# Altium project AutonomousVehicle_MotherBoard.PrjPcb (part 1 of 2)
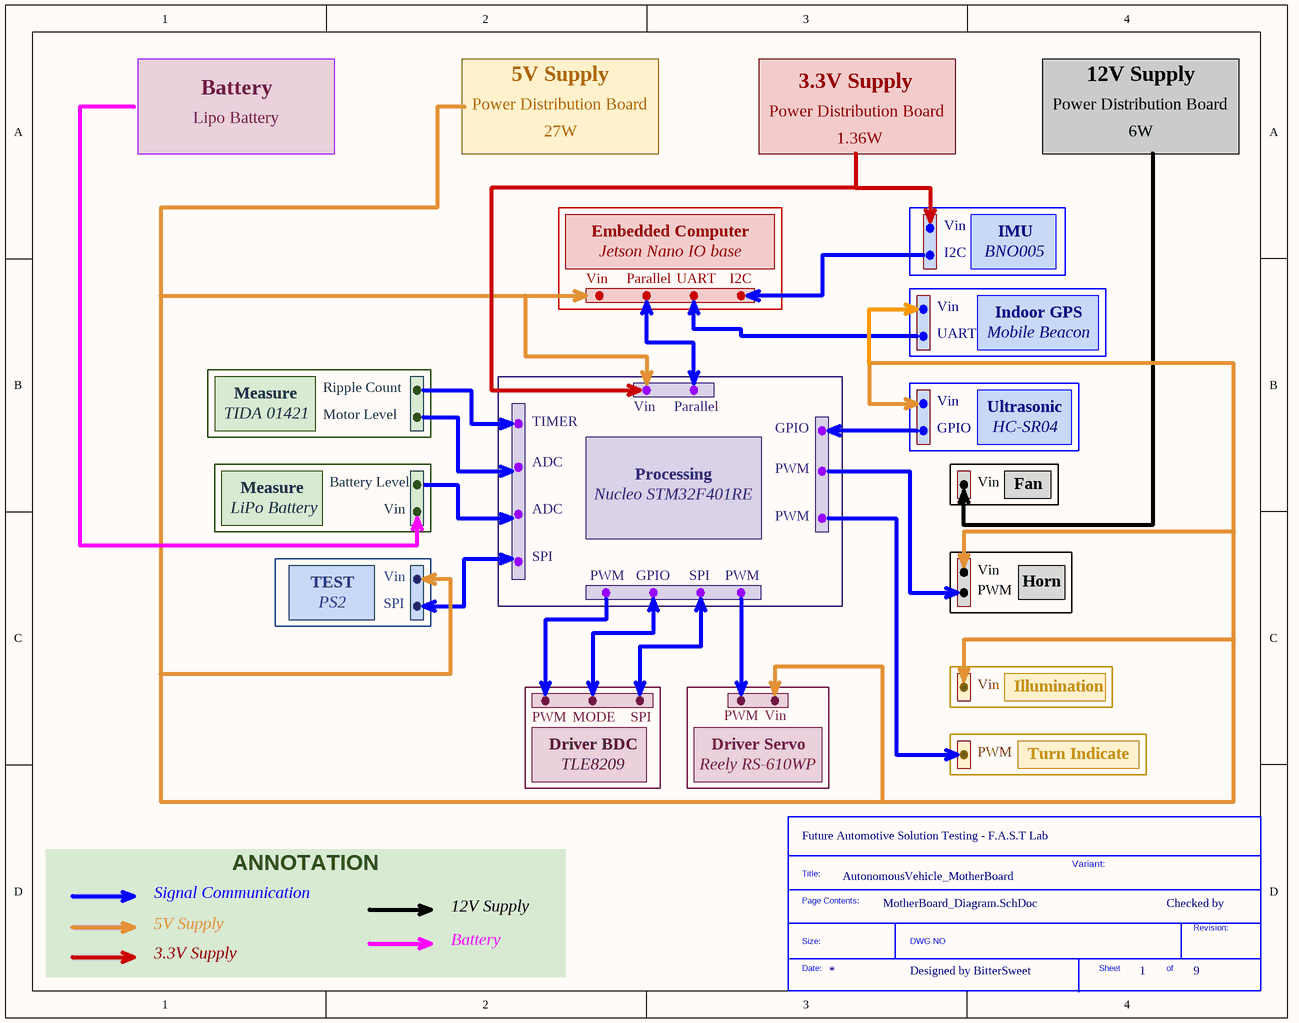
[diagram p0: MotherBoard_Diagram.SchDoc]
9 sheets, 112 parts. Net scope: flat (ports and power ports of the same name join across sheets).
Board file: MotherBoard_PCB.PcbDoc
Sheets:
  MotherBoard_Diagram.SchDoc
  MotherBoard_FileInfo.SchDoc
  MotherBoard_NucleoF401RE.SchDoc
  MotherBoard_AuxiliarySystem.SchDoc
  MotherBoard_Driver_Communication.SchDoc
  MotherBoard_Measure_Communication.SchDoc
  MotherBoard_Sensor_Communication.SchDoc
  MotherBoard_Test_Support.SchDoc
  MotherBoard_JetsonSupport.SchDoc

## Sheet MotherBoard_Diagram.SchDoc
size A; SheetNumber: 1; SheetTotal: 9

### Parts
(Parts that share a designator on the sheet are numbered #1, #2 ... from top to bottom, then left to right.)
*?#1  SDTitleBlock  (value not drawn)  (graphical)

### Notes on the sheet
- Battery
- 5V Supply
- 3.3V Supply
- 12V Supply
- Lipo Battery
- Power Distribution Board
- 27W
- 1.36W
- 6W
- Embedded Computer
- Vin
- IMU
- Jetson Nano IO base
- Parallel
- UART
- I2C
- BNO005
- Mobile Beacon
- Indoor GPS
- TIDA 01421
- Measure
- Ripple Count
- Motor Level
- TIMER
- GPIO
- Ultrasonic
- HC-SR04
- Battery Level
- ADC
- Nucleo STM32F401RE
- Processing
- PWM
- Fan
- LiPo Battery
- SPI
- TEST
- PS2
- Horn
- Illumination
- Driver BDC
- TLE8209
- MODE
- (near *?#1) Reely RS-610WP
- Driver Servo
- Turn Indicate
- (near *?#1) Future Automotive Solution Testing - F.A.S.T Lab
- Signal Communication
- AutonomousVehicle_MotherBoard
- Variant:
- Checked by
- ANNOTATION
- Designed by BitterSweet
- (in symbol SDTitleBlock) Title:; Page Contents:; Revision:; Size:; DWG NO; Date:; Sheet; of

## Sheet MotherBoard_FileInfo.SchDoc
size A; SheetNumber: 2; SheetTotal: 9
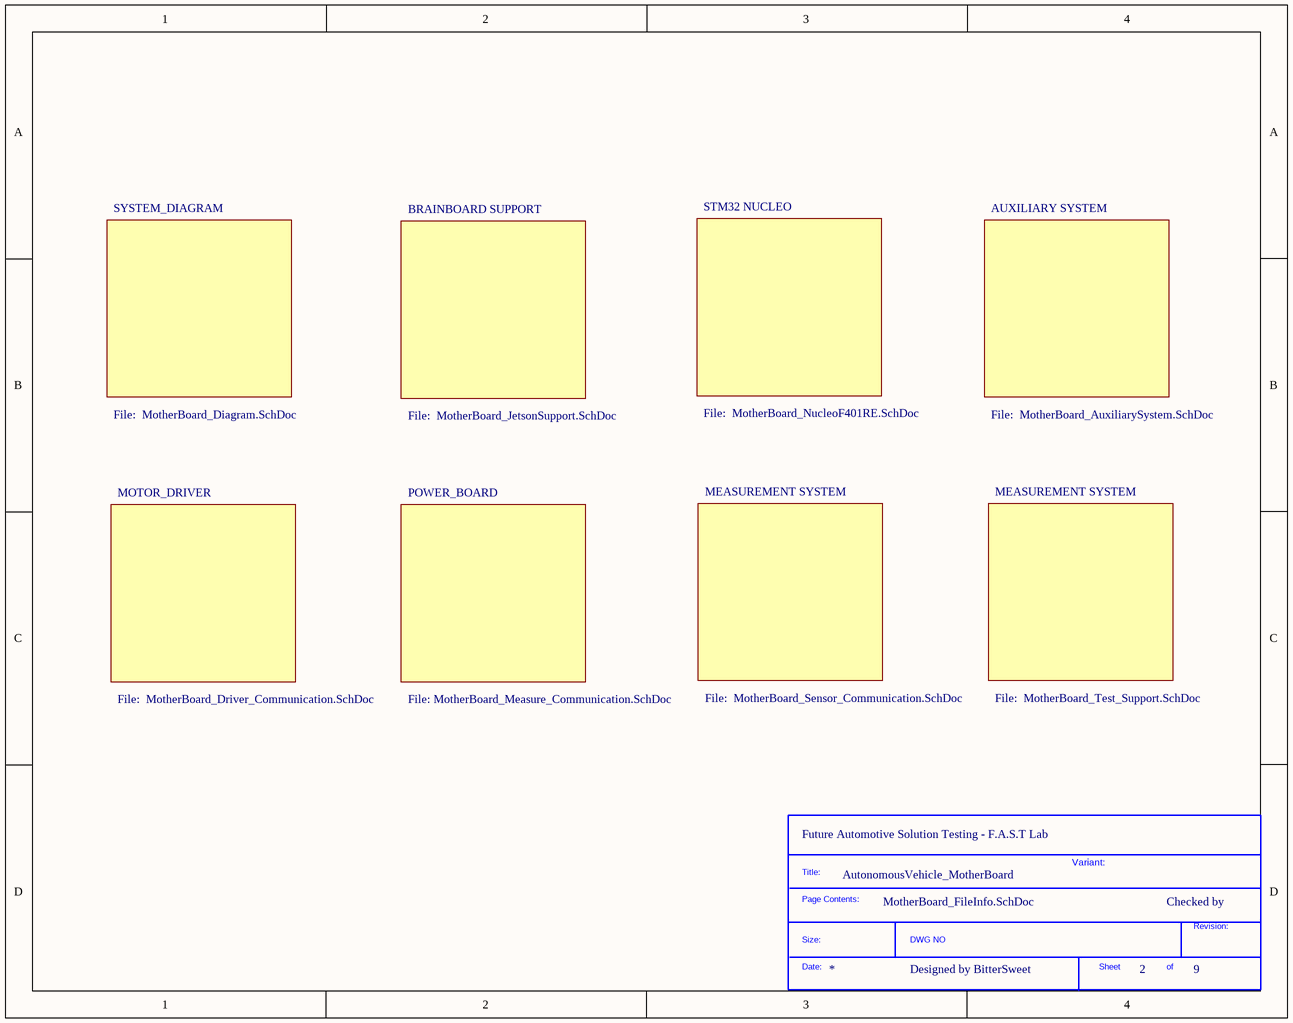
[diagram p1: MotherBoard_FileInfo.SchDoc]

### Parts
(Parts that share a designator on the sheet are numbered #1, #2 ... from top to bottom, then left to right.)
*?#2  SDTitleBlock  (value not drawn)  (graphical)

### Notes on the sheet
- SYSTEM_DIAGRAM
- BRAINBOARD SUPPORT
- STM32 NUCLEO
- AUXILIARY SYSTEM
- File:  MotherBoard_Diagram.SchDoc
- File:  MotherBoard_JetsonSupport.SchDoc
- File:  MotherBoard_NucleoF401RE.SchDoc
- File:  MotherBoard_AuxiliarySystem.SchDoc
- MOTOR_DRIVER
- POWER_BOARD
- MEASUREMENT SYSTEM
- File:  MotherBoard_Driver_Communication.SchDoc
- File: MotherBoard_Measure_Communication.SchDoc
- File:  MotherBoard_Sensor_Communication.SchDoc
- File:  MotherBoard_Test_Support.SchDoc
- (near *?#2) Future Automotive Solution Testing - F.A.S.T Lab
- AutonomousVehicle_MotherBoard
- Variant:
- Checked by
- Designed by BitterSweet
- (in symbol SDTitleBlock) Title:; Page Contents:; Revision:; Size:; DWG NO; Date:; Sheet; of

## Sheet MotherBoard_NucleoF401RE.SchDoc
size A; SheetNumber: 3; SheetTotal: 9
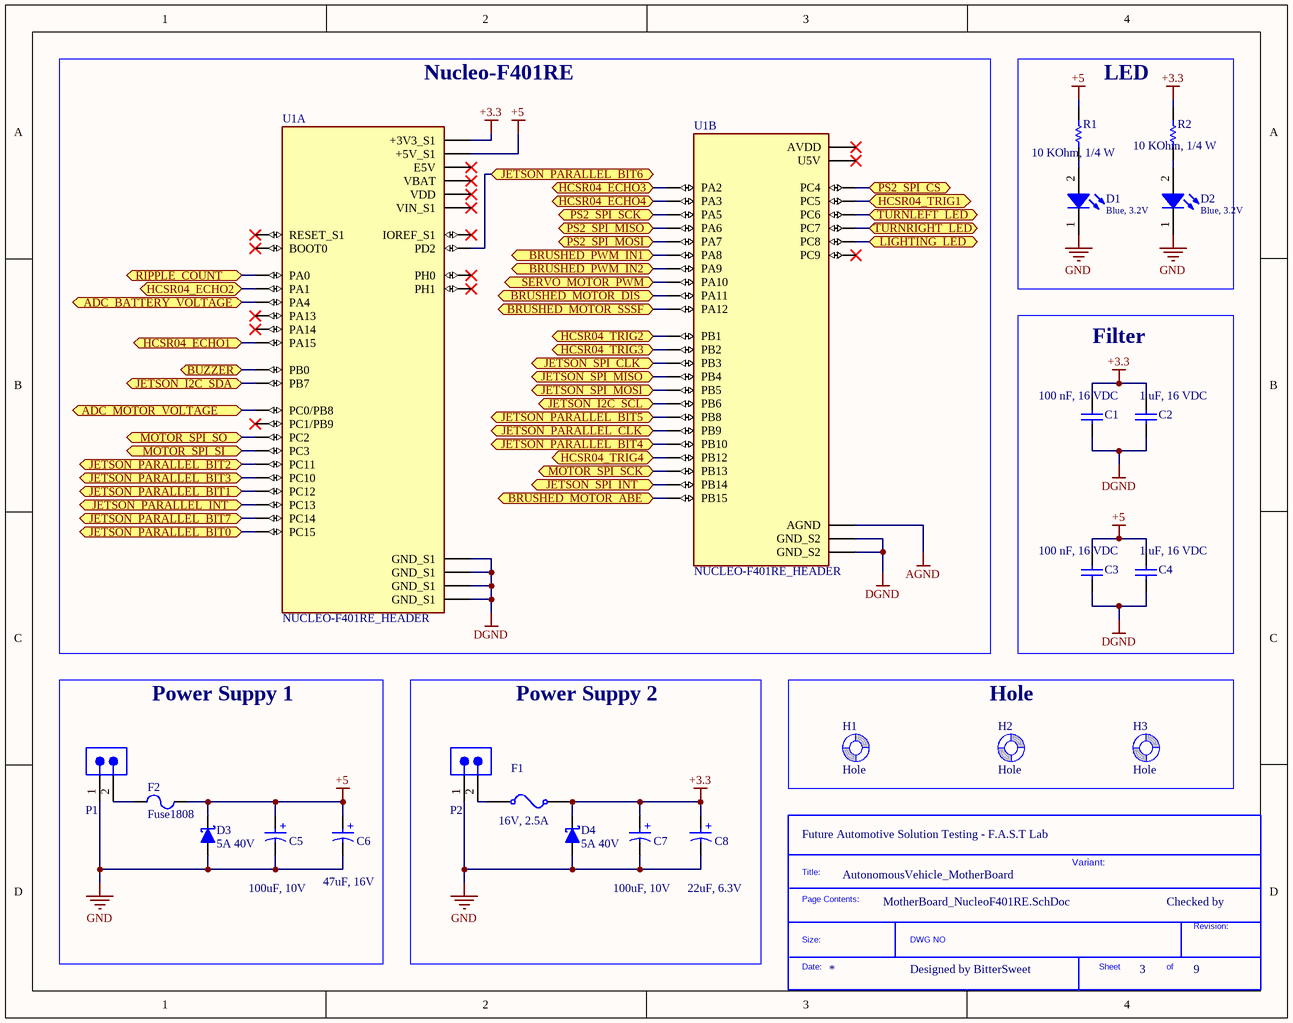
[diagram p2: MotherBoard_NucleoF401RE.SchDoc]

### Parts
(Parts that share a designator on the sheet are numbered #1, #2 ... from top to bottom, then left to right.)
*?#3  SDTitleBlock  (value not drawn)  (graphical)
C1  100 nF, 16 VDC  [CAP_0603]
C2  1 uF, 16 VDC  [CAP_0603]
C3  100 nF, 16 VDC  [CAP_0603]
C4  1 uF, 16 VDC  [CAP_0603]
C5  100uF, 10V  [WCAP-ASLI_D5H5.5]
C6  47uF, 16V  [WCAP-ASLI_D5H5.5]
C7  100uF, 10V  [WCAP-ASLI_D5H5.5]
C8  22uF, 6.3V  [WCAP-ASLI_D4H5.5]
D1  Blue, 3.2V  [WL-SMCW_0603_H=0.7mm]
D2  Blue, 3.2V  [WL-SMCW_0603_H=0.7mm]
D3  5A 40V  [DO-214AB, SMC]
D4  5A 40V  [DO-214AB, SMC]
F1  16V, 2.5A  [Fuse_SMD_1812]
F2  Fuse1808  [FuseHolder1808]
H1  Hole  [Hole_3.2mm]
H2  Hole  [Hole_3.2mm]
H3  Hole  [Hole_3.2mm]
P1  20A, 300V  [691312510002]  (value not drawn)
P2  20A, 300V  [691312510002]  (value not drawn)
R1  10 KOhm, 1/4 W  [resistor_0603]
R2  10 KOhm, 1/4 W  [resistor_0603]
U1  NUCLEO-F401RE_HEADER  [NUCLEO-F401RE-HEADER]  (parts A,B of 2)

### Blocks framed on the sheet
Nucleo-F401RE: U1
LED: D1 D2 R1 R2
Filter: C1-C4
Power Suppy 1: C5 C6 D3 F2 P1
Power Suppy 2: C7 C8 D4 F1 P2
Hole: H1-H3

### Ports
ADC_BATTERY_VOLTAGE (bidir), ADC_MOTOR_VOLTAGE (bidir), BRUSHED_MOTOR_ABE (bidir), BRUSHED_MOTOR_DIS (bidir), BRUSHED_MOTOR_SSSF (bidir), BRUSHED_PWM_IN1 (bidir), BRUSHED_PWM_IN2 (bidir), BUZZER (bidir), HCSR04_ECHO1 (bidir), HCSR04_ECHO2 (bidir), HCSR04_ECHO3 (bidir), HCSR04_ECHO4 (bidir), HCSR04_TRIG1 (bidir), HCSR04_TRIG2 (bidir), HCSR04_TRIG3 (bidir), HCSR04_TRIG4 (bidir), JETSON_I2C_SCL (bidir), JETSON_I2C_SDA (bidir), JETSON_PARALLEL_BIT0 (bidir), JETSON_PARALLEL_BIT1 (bidir), JETSON_PARALLEL_BIT2 (bidir), JETSON_PARALLEL_BIT3 (bidir), JETSON_PARALLEL_BIT4 (bidir), JETSON_PARALLEL_BIT5 (bidir), JETSON_PARALLEL_BIT6 (bidir), JETSON_PARALLEL_BIT7 (bidir), JETSON_PARALLEL_CLK (bidir), JETSON_PARALLEL_INT (bidir), JETSON_SPI_CLK (bidir), JETSON_SPI_INT (bidir), JETSON_SPI_MISO (bidir), JETSON_SPI_MOSI (bidir), LIGHTING_LED (bidir), MOTOR_SPI_SCK (bidir), MOTOR_SPI_SI (bidir), MOTOR_SPI_SO (bidir), PS2_SPI_CS (bidir), PS2_SPI_MISO (bidir), PS2_SPI_MOSI (bidir), PS2_SPI_SCK (bidir), RIPPLE_COUNT (bidir), SERVO_MOTOR_PWM (bidir), TURNLEFT_LED (bidir), TURNRIGHT_LED (bidir)

### Nets
+3.3: C1.2 C2.2 C7.1(P) C8.1(P) D4.2(K) F1.1 R2.1 U1.CN7_16(+3V3_S1)
+5: C3.2 C4.2 C5.1(P) C6.1(P) D3.2(K) F2.2 R1.1 U1.CN7_18(+5V_S1)
AGND: U1.CN10_32(AGND)
DGND: C1.1 C2.1 C3.1 C4.1 U1.CN7_8(GND_S1) U1.CN7_19(GND_S1) U1.CN7_20(GND_S1) U1.CN7_22(GND_S1) U1.CN10_9(GND_S2) U1.CN10_20(GND_S2)
GND: C5.2(N) C6.2(N) C7.2(N) C8.2(N) D1.1(K) D2.1(K) D3.1(A) D4.1(A) P1.1 P2.1
PS2_ATTENTION: U1.CN10_34(PC4) ; port PS2_SPI_CS
PS2_CLOCK: U1.CN10_11(PA5) ; port PS2_SPI_SCK
PS2_CMD: U1.CN10_13(PA6) ; port PS2_SPI_MISO
PS2_DATA: U1.CN10_15(PA7) ; port PS2_SPI_MOSI
NetD1_2: D1.2(A) R1.2
NetD2_2: D2.2(A) R2.2
NetF1_0: F1.0 P2.2
NetF2_1: F2.1 P1.2
NetP10_1: U1.CN10_23(PA8) ; port BRUSHED_PWM_IN1
NetP10_2: U1.CN10_21(PA9) ; port BRUSHED_PWM_IN2
NetP11_1: U1.CN7_35(PC2) ; port MOTOR_SPI_SO
NetP11_2: U1.CN7_37(PC3) ; port MOTOR_SPI_SI
NetP11_3: U1.CN10_30(PB13) ; port MOTOR_SPI_SCK
NetP12_1: U1.CN10_26(PB15) ; port BRUSHED_MOTOR_ABE
NetP12_2: U1.CN10_12(PA12) ; port BRUSHED_MOTOR_SSSF
NetP12_3: U1.CN10_14(PA11) ; port BRUSHED_MOTOR_DIS
NetP13_1: U1.CN7_28(PA0) ; port RIPPLE_COUNT
NetP14_1: U1.CN7_38(PC0/PB8) ; port ADC_MOTOR_VOLTAGE
NetP15_1: U1.CN7_32(PA4) ; port ADC_BATTERY_VOLTAGE
NetP16_2: U1.CN10_6(PC5) ; port HCSR04_TRIG1
NetP16_3: U1.CN7_17(PA15) ; port HCSR04_ECHO1
NetP18_2: U1.CN10_24(PB1) ; port HCSR04_TRIG2
NetP18_3: U1.CN7_30(PA1) ; port HCSR04_ECHO2
NetP19_2: U1.CN10_16(PB12) ; port HCSR04_TRIG4
NetP19_3: U1.CN10_37(PA3) ; port HCSR04_ECHO4
NetP20_2: U1.CN10_22(PB2) ; port HCSR04_TRIG3
NetP20_3: U1.CN10_35(PA2) ; port HCSR04_ECHO3
NetP24_1: U1.CN10_17(PB6) ; port JETSON_I2C_SCL
NetP24_2: U1.CN7_21(PB7) ; port JETSON_I2C_SDA
NetP26_1: U1.CN7_23(PC13) ; port JETSON_PARALLEL_INT
NetP26_2: U1.CN7_25(PC14) ; port JETSON_PARALLEL_BIT7
NetP26_3: U1.CN7_27(PC15) ; port JETSON_PARALLEL_BIT0
NetP26_4: U1.CN7_4(PD2) ; port JETSON_PARALLEL_BIT6
NetP26_5: U1.CN7_2(PC11) ; port JETSON_PARALLEL_BIT2
NetP26_6: U1.CN7_1(PC10) ; port JETSON_PARALLEL_BIT3
NetP26_7: U1.CN7_3(PC12) ; port JETSON_PARALLEL_BIT1
NetP26_8: U1.CN10_3(PB8) ; port JETSON_PARALLEL_BIT5
NetP26_9: U1.CN10_5(PB9) ; port JETSON_PARALLEL_CLK
NetP26_10: U1.CN10_25(PB10) ; port JETSON_PARALLEL_BIT4
NetP27_1: U1.CN10_27(PB4) ; port JETSON_SPI_MISO
NetP27_2: U1.CN10_29(PB5) ; port JETSON_SPI_MOSI
NetP27_3: U1.CN10_31(PB3) ; port JETSON_SPI_CLK
NetP27_4: U1.CN10_28(PB14) ; port JETSON_SPI_INT
NetQ5_2: U1.CN10_33(PA10) ; port SERVO_MOTOR_PWM
NetR3_1: U1.CN10_2(PC8) ; port LIGHTING_LED
NetR4_1: U1.CN10_4(PC6) ; port TURNLEFT_LED
NetR5_1: U1.CN10_19(PC7) ; port TURNRIGHT_LED
NetR9_1: U1.CN7_34(PB0) ; port BUZZER

Not connected (* = marked no-connect by the designer): H1 1(Screw); H2 1(Screw); H3 1(Screw); U1 CN7_5(VDD)* CN7_6(E5V)* CN7_7(BOOT0)* CN7_12(IOREF_S1)* CN7_13(PA13)* CN7_14(RESET_S1)* CN7_15(PA14)* CN7_24(VIN_S1)* CN7_29(PH0)* CN7_31(PH1)* CN7_33(VBAT)* CN7_36(PC1/PB9)* CN10_1(PC9)* CN10_7(AVDD)* CN10_8(U5V)*

### Notes on the sheet
- (near *?#3) Future Automotive Solution Testing - F.A.S.T Lab
- AutonomousVehicle_MotherBoard
- Variant:
- Checked by
- Designed by BitterSweet
- (in symbol 865080140001) +
- (in symbol 865080142007) +
- (in symbol 865080342006) +
- (in symbol SDTitleBlock) Title:; Page Contents:; Revision:; Size:; DWG NO; Date:; Sheet; of

### Library data of the parts
C1 C3 = 0106031041050: CAP, size 0603, 100 nF, 16 VDC; Manufacture Name: TDK; Manufacture SN: CGA3E3X8R1H104K080AE; Capacitance: 100 nF; Tolerance: +/-10%; Voltage Rating DC: 16 VDC; ComponentLink2Description: Datasheet; ComponentLink2URL: https://product.tdk.com/system/files/dam/doc/product/capacitor/ceramic/mlcc/catalog/mlcc_automotive_soft_en.pdf?ref_disty=mouser; Operating Temperature: -55 to +125degC; Packaging: Tape and Reel; Mounting Technology: SMT; Size: 0603; Supplier 1 Name: Mouser; Supplier 1 SN: 810-CGA3E3X8R1H104KA; Supplier 1 URL: https://www.mouser.com/ProductDetail/TDK/CGA3E3X8R1H104K080AE?qs=nQSIdc08i%252Bd8g3IRRgU2bw%3D%3D&utm_source=mouser-refine-download&utm_medium=file&utm_campaign=CGA3E3X8R1H104K080AE&utm_content=TDK; Supplier 2 Name: Digi-Key; Supplier 2 SN: 445-173697-2-ND; Supplier 2 URL: https://www.digikey.com/en/products/detail/tdk-corporation/cga3e3x8r1h104k080ae/5809262; Supplier 3 Name: thegioiic; Supplier 3 SN: N/A; Supplier 3 URL: https://www.thegioiic.com/tu-gom-0603-100nf-0-1uf-16v; Value: 100 nF, 16 VDC; JLCPCB Part: C2173920; ComponentLink3Description: JLCPCB Link; ComponentLink3URL: https://jlcpcb.com/partdetail/TaiyoYuden-EMK107B7104KAHT/C2173920
C2 C4 = 0106031051016: CAP, size 0603, 1 uF, 16 VDC; Manufacture Name: Samsung Electro-Mechanics; Manufacture SN: CL10B105KO8NNWC; Capacitance: 1 uF; Tolerance: +/-10%; Voltage Rating DC: 16 VDC; ComponentLink2Description: Datasheet; ComponentLink2URL: https://www.mouser.vn/datasheet/2/585/Samsung_MLCC_1837944-1929650.pdf; Operating Temperature: -55 to +125degC; Packaging: Tape and Reel; Mounting Technology: SMT; Size: 0603; Supplier 1 Name: Mouser; Supplier 1 SN: 187-CL10B105KO8NNWC; Supplier 1 URL: https://www.mouser.vn/ProductDetail/Samsung-Electro-Mechanics/CL10B105KO8NNWC?qs=81r%252BiQLm7BT%252BXtc72qn1ug%3D%3D&utm_source=mouser-refine-download&utm_medium=file&utm_campaign=CL10B105KO8NNWC&utm_content=Samsung-Electro-Mechanics; Supplier 2 Name: Digi-Key; Supplier 2 SN: 1276-CL10B105KO8NNWCTR-ND; Supplier 2 URL: https://www.digikey.com/en/products/detail/samsung-electro-mechanics/cl10b105ko8nnwc/16572783; Supplier 3 Name: thegioiic; Supplier 3 SN: N/A; Supplier 3 URL: https://www.thegioiic.com/tu-gom-0603-1uf-16v; Value: 1 uF, 16 VDC; JLCPCB Part: C106858; ComponentLink3Description: JLCPCB Link; ComponentLink3URL: https://jlcpcb.com/partdetail/Yageo-CC0603KRX7R8BB105/C106858
C5 C7 = 865080142007: V-Chip, D5 x H5.5mm, 100uF, 10V; Manufacturer: Wurth Elektronik; Capacitance Tolerance: +/-20%; Dissipation Factor: 24%; Endurance: 2000h; Leakage Current: 6.3uA; Ripple Current: 170mA; Category: Aluminum Electrolytic Capacitors; ComponentLink2Description: Datasheet Link; ComponentLink2URL: https://www.we-online.com/redexpert/spec/865080142007?ad; Operating Temperature Max: 105°C; Operating Temperature Min: -55°C; Packaging: Tape and Reel; Height: 5.5mm; Diameter: 5mm; Capacitance: 100uF; Rated Voltage (DC): 10V; Supplier 1 Name: Mouser; Supplier 1 SN: 710-865080142007; Supplier 1 URL: https://www.mouser.vn/ProductDetail/Wurth-Elektronik/865080142007?qs=0KOYDY2FL2%2Fwso3YmuIP2w%3D%3D; Supplier 3 Name: thegioiic; Supplier 3 URL: https://www.thegioiic.com/tu-nhom-smd-100uf-10v-5x5-4mm-panasonic-eee1aa101war; Manufacturer Part Number: N/A; Mount: Surface Mount; Supplier 2 Name: Digi-Key; Supplier 2 SN: N/A; Supplier 2 URL: N/A; Supplier 3 SN: N/A; Value: 100uF, 10V; JLCPCB Part: C402534; ComponentLink3Description: JLCPCB Link; ComponentLink3URL: https://jlcpcb.com/partdetail/387824-HV101M010C055ETR/C402534
C6 = 865080342006: V-Chip, D5 x H5.5mm, 47uF, 16V; Manufacturer: Wurth Elektronik; Capacitance Tolerance: +/-20%; Dissipation Factor: 16%; Endurance: 2000h; Leakage Current: 7.52uA; Ripple Current: 195mA; Category: Aluminum Electrolytic Capacitors; ComponentLink2Description: Datasheet Link; ComponentLink2URL: https://www.we-online.com/redexpert/spec/865080342006?ad; Mount: Surface Mount; Operating Temperature Max: 105°C; Operating Temperature Min: -55°C; Packaging: Tape and Reel; Height: 5.5mm; Diameter: 5mm; Capacitance: 47uF; Rated Voltage (DC): 16V; Supplier 1 Name: Mouser; Supplier 1 SN: 710-865080262015; Supplier 1 URL: https://www.mouser.com/ProductDetail/Wurth-Elektronik/865080262015?qs=0KOYDY2FL2%2Ffe5w2MssUoQ%3D%3D; Supplier 3 Name: thegioiic; Supplier 3 URL: https://www.thegioiic.com/tu-nhom-smd-47uf-16v-5x5-4mm; Manufacturer Part Number: N/A; Supplier 2 Name: Digi-Key; Supplier 2 SN: N/A; Supplier 2 URL: N/A; Supplier 3 SN: N/A; Value: 47uF, 16V; JLCPCB Part: C84357; ComponentLink3Description: JLCPCB Link; ComponentLink3URL: https://jlcpcb.com/partdetail/85527-ZV470M016C055ETR/C84357
C8 = 865080140001: V-Chip, D4 x H5.8mm, 22uF, 6.3V; Manufacturer: Wurth Elektronik; Capacitance Tolerance: +/-20%; Dissipation Factor: 24%; Endurance: 2000h; Leakage Current: 3uA; Ripple Current: 75mA; Category: Aluminum Electrolytic Capacitors; ComponentLink2Description: Datasheet Link; ComponentLink2URL: https://www.we-online.com/redexpert/spec/865080140001?ad; Mount: Surface Mount; Operating Temperature Max: 105°C; Operating Temperature Min: -55°C; Packaging: Tape and Reel; Height: 5.8mm; Diameter: 4mm; Capacitance: 22uF; Rated Voltage (DC): 6.3V; Supplier 1 Name: Mouser; Supplier 1 SN: 865080140001; Supplier 1 URL: https://www.mouser.vn/ProductDetail/Wurth-Elektronik/865080140001?qs=0KOYDY2FL2%2FITcChMQdw%252BQ%3D%3D&_gl=1*175azx5*_ga*MzUyMDUxMTAxLjE2ODc3NDI0MDM.*_ga_15W4STQT4T*MTY4OTEwMTM0NC4yLjAuMTY4OTEwMTM0NS4wLjAuMA..*_ga_1KQLCYKRX3*MTY4OTEwMTM0NC4yLjAuMTY4OTEwMTM0NS41OS4wLjA.; Supplier 3 Name: thegioiic; Supplier 3 SN: EEEFP0J220AR; Supplier 3 URL: https://www.thegioiic.com/tu-nhom-smd-22uf-6-3v-4x5-8mm-panasonic-eeefp0j220ar; Manufacturer Part Number: N/A; Supplier 2 Name: Digi-Key; Supplier 2 SN: N/A; Supplier 2 URL: N/A; Value: 22uF, 6.3V; ComponentLink3Description: JLCPCB Link; ComponentLink3URL: https://jlcpcb.com/partdetail/Panasonic-EEEFKC220UAR/C401733; JLCPCB Part: C401733
D1 D2 = 160603BlueClear: WL-SMCW SMT Mono-color Chip LED Waterclear, size 0603, Blue, 3.2V, 140deg; Type: Clear; Color: Blue; Size: 0603; ComponentLink1Description: Datasheet link; ComponentLink1URL: N/A; ComponentLink2Description: Supplier 1 URL; ComponentLink2URL: https://www.mouser.vn/ProductDetail/Wurth-Elektronik/150060BS75003?qs=Li%252BoUPsLEnu8LvIbM48DKA%3D%3D; ComponentLink3Description: Supplier 2 URL; ComponentLink3URL: https://www.digikey.com/en/products/detail/liteon/LTST-C191TBKT/388530; ComponentLink4Description: Supplier 3 URL; ComponentLink4URL: https://www.thegioiic.com/led-xanh-duong-0603-dan-smd-trong-suot; Supplier 1 Name: Mouser; Supplier 1 SN: 710-150060GS75000; Supplier 1 URL: https://www.mouser.vn/ProductDetail/Wurth-Elektronik/150060BS75003?qs=Li%252BoUPsLEnu8LvIbM48DKA%3D%3D; Supplier 2 Name: Digi-Key; Supplier 2 SN: 160-1647-2-ND; Supplier 2 URL: https://www.digikey.com/en/products/detail/liteon/LTST-C191TBKT/388530; Supplier 3 Name: ICDayRoi; Supplier 3 SN: N/A; Supplier 3 URL: https://www.thegioiic.com/led-xanh-duong-0603-dan-smd-trong-suot; Value: Blue, 3.2V; JLCPCB Part: C99290; ComponentLink5Description: JLCPCB Link; ComponentLink5URL: https://jlcpcb.com/partdetail/LiteOn-LTSTC191TBKT/C99290
D3 D4 = Diode_Schottky: SS54 SMC Diode Schottky 5A 40V; JLCPCB Part: C2904822; ComponentLink1Description: JLCPCB Link; ComponentLink1URL: https://jlcpcb.com/partdetail/YONGYUTAI-SS54/C2904822
F1 = 061812250016: Resettable Fuse, Size 1812, 16V, 2.5A; Manufacturer: Bourns; Threshold Current: 100A; Trip Current: 5A; Threshold Voltage: 16V; Hold Current: 2.5A; Size: 1812; Mounting Technology: SMT/SMD; ComponentLink1Description: Datasheet link; ComponentLink1URL: https://www.bourns.com/docs/Product-Datasheets/mfnsmf.pdf; ComponentLink2Description: Supplier 1 URL; ComponentLink2URL: https://www.mouser.vn/ProductDetail/Bourns/MF-MSMF250-16X-2?qs=9fn1gpisni78zr7pGyDhCQ%3D%3D; ComponentLink3Description: Supplier 2 URL; ComponentLink3URL: https://www.digikey.com/en/products/detail/bourns-inc/MF-MSMF250-16X-2/2563289; ComponentLink4Description: Supplier 3 URL; ComponentLink4URL: https://www.thegioiic.com/mf-msmf250-16-cau-chi-tu-phuc-hoi-1812-16v-2-5a; Supplier 1 Name: Mouser; Supplier 1 SN: 652-MF-MSMF250/16X-2; Supplier 1 URL: https://www.mouser.vn/ProductDetail/Bourns/MF-MSMF250-16X-2?qs=9fn1gpisni78zr7pGyDhCQ%3D%3D; Supplier 2 Name: Digi-Key; Supplier 2 SN: MF-MSMF250/16X-2TR-ND; Supplier 2 URL: https://www.mouser.vn/ProductDetail/Bourns/MF-MSMF250-16X-2?qs=9fn1gpisni78zr7pGyDhCQ%3D%3D; Supplier 3 Name: thegioiic; Supplier 3 SN: MF-MSMF250/16; Supplier 3 URL: https://www.thegioiic.com/mf-msmf250-16-cau-chi-tu-phuc-hoi-1812-16v-2-5a; Value: 16V, 2.5A; JLCPCB Part: C210838; ComponentLink5Description: JLCPCB Link; ComponentLink5URL: https://jlcpcb.com/jp/partdetail/BOURNS-MF_MSMF250_16X2/C210838
F2 = Fuse1808: Fuse 1808 Holder SMD fast blow L9.73xW5.03xH3.81; JLCPCB Part: C206917; ComponentLink1Description: JLCPCB Link; ComponentLink1URL: https://jlcpcb.com/partdetail/Littelfuse-0154005DRT/C206917
P1 P2 = 691312510002: WR-TBL Series 312 Open Horizontal PCB Header, THT, pitch 5.08mm, 2p; Manufacturer: Wurth Elektronik; Modularity: No; ComponentLink1Description: Datasheet Link; ComponentLink1URL: https://www.we-online.com/redexpert/spec/691312510002?ad; ComponentLink2Description: Supplier 1 URL; ComponentLink2URL: N/A; Manufacturer Part Number: 691312510002; Category: Terminal Blocks; Match Code: WR-TBL; Mount: Through Hole; Operating Temperature Max: 105°C; Operating Temperature Min: -40°C; Packaging: Box; Application: Pluggable; Number of Pins: 2; Number of Rows: 1; Orientation: Horizontal; Pitch: 5.08mm; Rated Current: 20A; Working Voltage: 300V; ComponentLink3Description: Supplier 2 URL; ComponentLink3URL: N/A; ComponentLink4Description: Supplier 3 URL; ComponentLink4URL: https://www.thegioiic.com/kf-5-08-2-r-terminal-block-plug-in-han-pcb-2-chan-cong-5-08mm-300v-15a; Supplier 1 Name: Mouser; Supplier 1 SN: N/A; Supplier 1 URL: N/A; Supplier 2 Name: Digi-Key; Supplier 2 SN: N/A; Supplier 2 URL: N/A; Supplier 3 Name: thegioiic; Supplier 3 SN: N/A; Supplier 3 URL: https://www.thegioiic.com/kf-5-08-2-r-terminal-block-plug-in-han-pcb-2-chan-cong-5-08mm-300v-15a; Value: 20A, 300V
R1 R2 = 0006031031: RES, size 0603, 10 KOhm, 1/4 W; Manufacture  Name: OEM; Resistance: 10 KOhm; Rated Power: 1/4 W; Resistance Tolerance: +/-1%; Size: 0603; Mounting Technology: SMT; Supplier 1 Name: Mouser; Supplier 1 SN: 755-ESR03EZPF1002; Supplier 2 Name: Digi-Key; Supplier 2 SN: RHM10KADTR-ND RHM10KADCT-ND RHM10KADDKR-ND; Supplier 1 URL: https://www.mouser.vn/ProductDetail/ROHM-Semiconductor/ESR03EZPF1002?qs=sGAEpiMZZMvdGkrng054t67Efho1F8r6CDeAsqwFse8%3D; Supplier 3 Name: thegioiic; Supplier 3 SN: N/A; Supplier 3 URL: N/A; Manufacture  SN: OEM; Value: 10 KOhm, 1/4 W; ComponentLink1Description: Datasheet link; ComponentLink1URL: https://fscdn.rohm.com/en/products/databook/datasheet/passive/resistor/chip_resistor/esr-e.pdf; ComponentLink2Description: Supplier 1 URL; ComponentLink2URL: https://www.thegioiic.com/dien-tro-10-kohm-0603-1-; ComponentLink3Description: Supplier 2 URL; ComponentLink3URL: https://www.digikey.com/en/products/detail/rohm-semiconductor/ESR03EZPF1002/1983429; ComponentLink4Description: Supplier 3 URL; ComponentLink4URL: N/A; Supplier 2 URL: https://www.digikey.com/en/products/detail/rohm-semiconductor/ESR03EZPF1002/1983429; JLCPCB Part: C2087321; Parameter 1: *; ComponentLink5Description: JLCPCB Link; ComponentLink5URL: https://jlcpcb.com/partdetail/Yageo-RT0603BRD1010KL/C2087321
U1 = NUCLEO-F401RE_HEADER: STM32 Nucleo-64 development board with STM32F401RET6 MCU, supports Arduino and ST morpho connectivity; Availability: Unavailable; Price: None; Package: None; MP: NUCLEO-F401RE; Value: *

## Sheet MotherBoard_AuxiliarySystem.SchDoc
size A; SheetNumber: 4; SheetTotal: 9
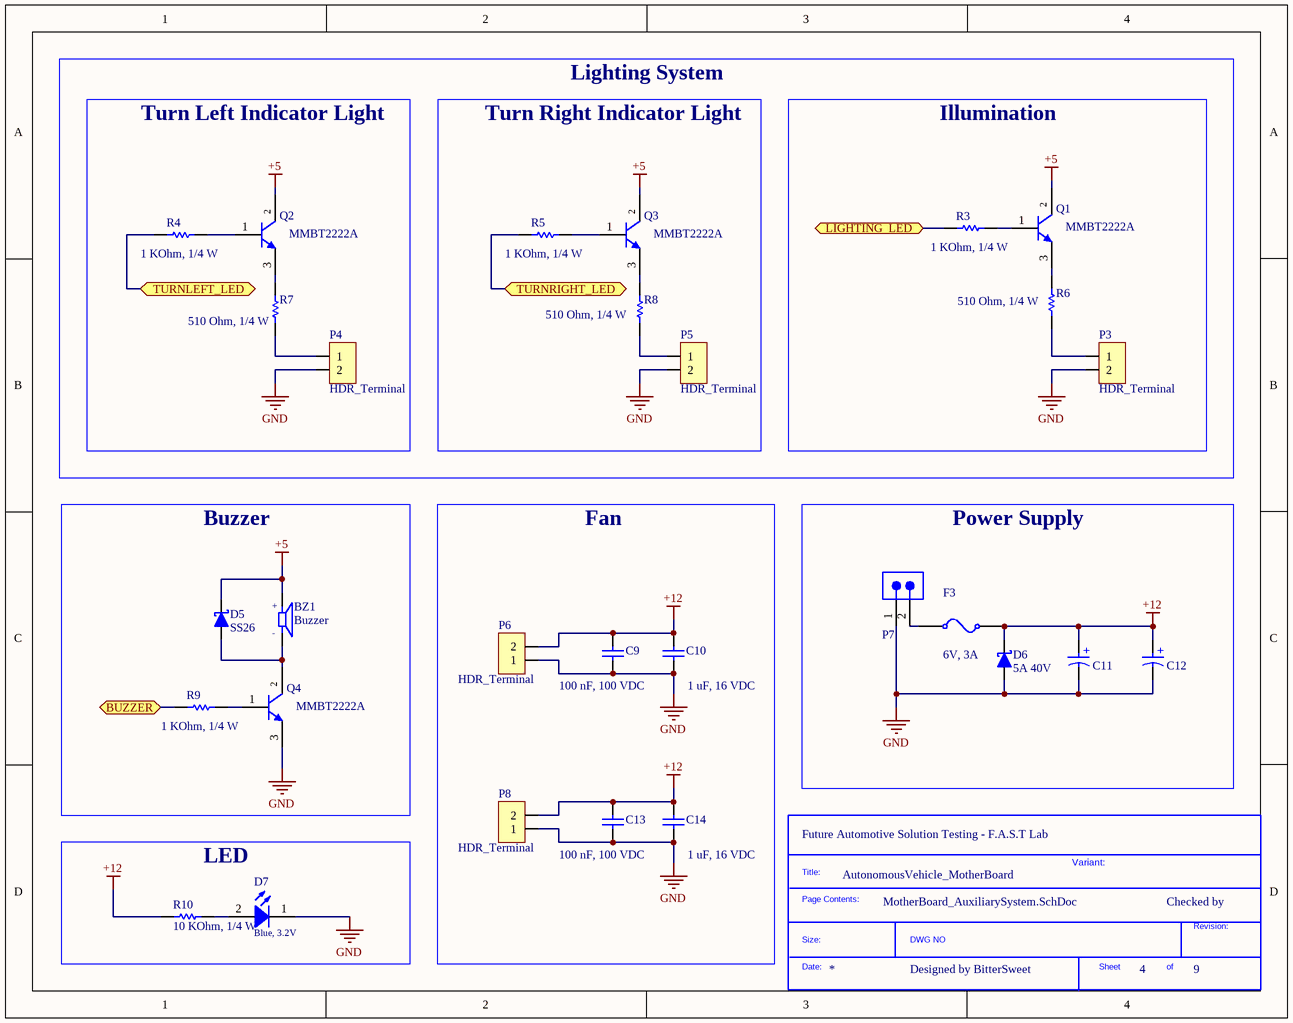
[diagram p3: MotherBoard_AuxiliarySystem.SchDoc]

### Parts
(Parts that share a designator on the sheet are numbered #1, #2 ... from top to bottom, then left to right.)
*?#4  SDTitleBlock  (value not drawn)  (graphical)
BZ1  Buzzer  [BUZZER_DIP_9X4.2]
C9  100 nF, 100 VDC  [CAP_0603]
C10  1 uF, 16 VDC  [CAP_0603]
C11  100uF, 16V  [WCAP-ASLI_D6.3H5.5]  (value not drawn)
C12  10uF, 25V  [WCAP-ASLI_D4H5.5]  (value not drawn)
C13  100 nF, 100 VDC  [CAP_0603]
C14  1 uF, 16 VDC  [CAP_0603]
D5  SS26  [DO-214AB, SMA]
D6  5A 40V  [DO-214AB, SMA]
D7  Blue, 3.2V  [WL-SMCW_0603_H=0.7mm]
F3  6V, 3A  [Fuse_SMD_1812]
P3  HDR_Terminal  [HDR_HEADER_2.0_HORIZONTAL]
P4  HDR_Terminal  [HDR_HEADER_2.0_HORIZONTAL]
P5  HDR_Terminal  [HDR_HEADER_2.0_HORIZONTAL]
P6  HDR_Terminal  [HDR_HEADER_2.0_HORIZONTAL]
P7  20A, 300V  [691312510002]  (value not drawn)
P8  HDR_Terminal  [HDR_HEADER_2.0_HORIZONTAL]
Q1  MMBT2222A  [MMBT-SOT23]
Q2  MMBT2222A  [MMBT-SOT23]
Q3  MMBT2222A  [MMBT-SOT23]
Q4  MMBT2222A  [MMBT-SOT23]
R3  1 KOhm, 1/4 W  [resistor_0603]
R4  1 KOhm, 1/4 W  [resistor_0603]
R5  1 KOhm, 1/4 W  [resistor_0603]
R6  510 Ohm, 1/4 W  [resistor_0603]
R7  510 Ohm, 1/4 W  [resistor_0603]
R8  510 Ohm, 1/4 W  [resistor_0603]
R9  1 KOhm, 1/4 W  [resistor_0603]
R10  10 KOhm, 1/4 W  [resistor_0603]

### Blocks framed on the sheet
Turn Left Indicator Light: P4 Q2 R4 R7
Illumination: P3 Q1 R3 R6
Buzzer: BZ1 D5 Q4 R9
Fan: C9 C10 C13 C14 P6 P8
Power Supply: C11 C12 D6 F3 P7
LED: D7 R10

### Ports
BUZZER (bidir), LIGHTING_LED (bidir), TURNLEFT_LED (bidir), TURNRIGHT_LED (bidir)

### Nets
+5: BZ1.P D5.2(K) Q1.2(C) Q2.2(C) Q3.2(C)
+12: C9.2 C10.2 C11.1(P) C12.1(P) C13.2 C14.2 D6.2(K) F3.1 P6.2 P8.2 R10.1
GND: C9.1 C10.1 C11.2(N) C12.2(N) C13.1 C14.1 D6.1(A) D7.1(K) P3.2 P4.2 P5.2 P6.1 P7.1 P8.1 Q4.3(E)
NetBZ1_M: BZ1.M D5.1(A) Q4.2(C)
NetD7_2: D7.2(A) R10.2
NetF3_0: F3.0 P7.2
NetP3_1: P3.1 R6.1
NetP4_1: P4.1 R7.1
NetP5_1: P5.1 R8.1
NetQ1_1: Q1.1(B) R3.2
NetQ1_3: Q1.3(E) R6.2
NetQ2_1: Q2.1(B) R4.2
NetQ2_3: Q2.3(E) R7.2
NetQ3_1: Q3.1(B) R5.2
NetQ3_3: Q3.3(E) R8.2
NetQ4_1: Q4.1(B) R9.2
NetR3_1: R3.1 ; port LIGHTING_LED
NetR4_1: R4.1 ; port TURNLEFT_LED
NetR5_1: R5.1 ; port TURNRIGHT_LED
NetR9_1: R9.1 ; port BUZZER

### Notes on the sheet
- Lighting System
- Turn Right Indicator Light
- (near *?#4) Future Automotive Solution Testing - F.A.S.T Lab
- AutonomousVehicle_MotherBoard
- Variant:
- Checked by
- Designed by BitterSweet
- (in symbol 865080343009) +
- (in symbol 865080440002) +
- (in symbol Buzzer) +; -
- (in symbol SDTitleBlock) Title:; Page Contents:; Revision:; Size:; DWG NO; Date:; Sheet; of

### Library data of the parts
BZ1 = Buzzer: Frequency DIP Buzzer, 9x4.2mm, 80dB, 9056-TS; URL: https://www.thegioiic.com/9056-ts-dip-buzzer-tan-so-9x4-2mm-80db
C9 C13 = 0106031041050: as C1 on sheet MotherBoard_NucleoF401RE; ComponentLink2Description: Datasheet; ComponentLink2URL: https://product.tdk.com/system/files/dam/doc/product/capacitor/ceramic/mlcc/catalog/mlcc_automotive_soft_en.pdf?ref_disty=mouser; Operating Temperature: -55 to +125degC; Packaging: Tape and Reel; Mounting Technology: SMT; Size: 0603; Supplier 1 Name: Mouser; Supplier 1 SN: 810-CGA3E3X8R1H104KA; Supplier 1 URL: https://www.mouser.com/ProductDetail/TDK/CGA3E3X8R1H104K080AE?qs=nQSIdc08i%252Bd8g3IRRgU2bw%3D%3D&utm_source=mouser-refine-download&utm_medium=file&utm_campaign=CGA3E3X8R1H104K080AE&utm_content=TDK; Supplier 2 Name: Digi-Key; Supplier 2 SN: 445-173697-2-ND; Supplier 2 URL: https://www.digikey.com/en/products/detail/tdk-corporation/cga3e3x8r1h104k080ae/5809262; Supplier 3 Name: thegioiic; Supplier 3 SN: N/A; Supplier 3 URL: N/A; Value: 100 nF, 100 VDC; ComponentLink3Description: JLCPCB Link; ComponentLink3URL: https://jlcpcb.com/partdetail/89397-0603B104K101NT/C88219; JLCPCB Part: C88219
C10 C14 = 0106031051016: as C2 on sheet MotherBoard_NucleoF401RE; ComponentLink2Description: Datasheet; ComponentLink2URL: https://www.mouser.vn/datasheet/2/585/Samsung_MLCC_1837944-1929650.pdf; Operating Temperature: -55 to +125degC; Packaging: Tape and Reel; Mounting Technology: SMT; Size: 0603; Supplier 1 Name: Mouser; Supplier 1 SN: 187-CL10B105KO8NNWC; Supplier 1 URL: https://www.mouser.vn/ProductDetail/Samsung-Electro-Mechanics/CL10B105KO8NNWC?qs=81r%252BiQLm7BT%252BXtc72qn1ug%3D%3D&utm_source=mouser-refine-download&utm_medium=file&utm_campaign=CL10B105KO8NNWC&utm_content=Samsung-Electro-Mechanics; Supplier 2 Name: Digi-Key; Supplier 2 SN: 1276-CL10B105KO8NNWCTR-ND; Supplier 2 URL: https://www.digikey.com/en/products/detail/samsung-electro-mechanics/cl10b105ko8nnwc/16572783; Supplier 3 Name: thegioiic; Supplier 3 SN: N/A; Supplier 3 URL: https://www.thegioiic.com/tu-gom-0603-1uf-16v; Value: 1 uF, 16 VDC; ComponentLink3Description: JLCPCB Link; ComponentLink3URL: https://jlcpcb.com/partdetail/172593-GCM188R71C105KA64D/C161212; JLCPCB Part: C161212
C11 = 865080343009: V-Chip, D6.3 x H5.5mm, 100uF, 16V; Manufacturer: Wurth Elektronik; Capacitance Tolerance: +/-20%; Dissipation Factor: 16%; Endurance: 2000h; Leakage Current: 16uA; Ripple Current: 255mA; Category: Aluminum Electrolytic Capacitors; ComponentLink2Description: Datasheet Link; ComponentLink2URL: https://www.we-online.com/redexpert/spec/865080343009?ad; Mount: Surface Mount; Operating Temperature Max: 105°C; Operating Temperature Min: -55°C; Packaging: Tape and Reel; Height: 5.5mm; Diameter: 6.3mm; Capacitance: 100uF; Rated Voltage (DC): 16V; Supplier 1 Name: Mouser; Supplier 1 SN: 710-865080343009; Supplier 1 URL: https://www.mouser.com/ProductDetail/Wurth-Elektronik/865080343009?qs=0KOYDY2FL28Gid9q%2FqirTQ%3D%3D; Supplier 3 Name: thegioiic; Supplier 3 URL: https://www.thegioiic.com/tu-nhom-smd-100uf-16v-6-3x5-4mm; Manufacturer Part Number: N/A; Supplier 2 Name: Digi-Key; Supplier 2 SN: N/A; Supplier 2 URL: N/A; Supplier 3 SN: N/A; Value: 100uF, 16V
C12 = 865080440002: V-Chip, D4 x H5.5mm, 10uF, 25V; Manufacturer: Wurth Elektronik; Capacitance Tolerance: +/-20%; Dissipation Factor: 14%; Endurance: 2000h; Leakage Current: 3uA; Ripple Current: 85mA; Category: Aluminum Electrolytic Capacitors; ComponentLink2Description: Datasheet Link; ComponentLink2URL: https://www.we-online.com/redexpert/spec/865080440002?ad; Mount: Surface Mount; Operating Temperature Max: 105°C; Operating Temperature Min: -55°C; Packaging: Tape and Reel; Height: 5.5mm; Diameter: 4mm; Capacitance: 10uF; Rated Voltage (DC): 25V; Supplier 1 Name: Mouser; Supplier 1 SN: 710-865080440002; Supplier 1 URL: https://www.mouser.com/ProductDetail/Wurth-Elektronik/865080440002?qs=0KOYDY2FL2%2FXvxJ7qSnXzw%3D%3D; Supplier 3 Name: thegioiic; Supplier 3 URL: https://www.thegioiic.com/tu-nhom-smd-10uf-25v-4x5-4mm; Manufacturer Part Number: N/A; Supplier 2 Name: Digi-Key; Supplier 2 SN: N/A; Supplier 2 URL: N/A; Supplier 3 SN: N/A; Value: 10uF, 25V
D5 = Diode_Schottky: SS26 SMA Diode Schottky 5A 40V; ComponentLink1Description: JLCPCB Link; ComponentLink1URL: https://jlcpcb.com/partdetail/Yint-SS26/C5123304; JLCPLCB Part: C5123304
D6 = Diode_Schottky: SS54 SMC Diode Schottky 5A 40V
D7 = 160603BlueClear: as D1 on sheet MotherBoard_NucleoF401RE; Color: Blue; Size: 0603; ComponentLink1Description: Datasheet link; ComponentLink1URL: N/A; ComponentLink2Description: Supplier 1 URL; ComponentLink2URL: https://www.mouser.vn/ProductDetail/Wurth-Elektronik/150060BS75003?qs=Li%252BoUPsLEnu8LvIbM48DKA%3D%3D; ComponentLink3Description: Supplier 2 URL; ComponentLink3URL: https://www.digikey.com/en/products/detail/liteon/LTST-C191TBKT/388530; ComponentLink4Description: Supplier 3 URL; ComponentLink4URL: https://www.thegioiic.com/led-xanh-duong-0603-dan-smd-trong-suot; Supplier 1 Name: Mouser; Supplier 1 SN: 710-150060GS75000; Supplier 1 URL: https://www.mouser.vn/ProductDetail/Wurth-Elektronik/150060BS75003?qs=Li%252BoUPsLEnu8LvIbM48DKA%3D%3D; Supplier 2 Name: Digi-Key; Supplier 2 SN: 160-1647-2-ND; Supplier 2 URL: https://www.digikey.com/en/products/detail/liteon/LTST-C191TBKT/388530; Supplier 3 Name: ICDayRoi; Supplier 3 SN: N/A; Supplier 3 URL: https://www.thegioiic.com/led-xanh-duong-0603-dan-smd-trong-suot; Value: Blue, 3.2V; JLCPCB Part: C99290; ComponentLink5Description: JLCPCB Link; ComponentLink5URL: https://jlcpcb.com/partdetail/LiteOn-LTSTC191TBKT/C99290
F3 = 061812300006: Resettable Fuse, Size 1812, 6V, 3A; Manufacturer: Littelfuse; Threshold Current: 100A; Trip Current: 6A; Threshold Voltage: 6V; Hold Current: 3A; Size: 1812; Mounting Technology: SMT/SMD; ComponentLink1Description: Datasheet link; ComponentLink1URL: https://www.littelfuse.com/~/media/electronics/product_specifications/resettable_ptcs/littelfuse_ptc_minismdc300f_2_product_specification.pdf.pdf; ComponentLink2Description: Supplier 1 URL; ComponentLink2URL: https://www.mouser.vn/ProductDetail/Littelfuse/MINISMDC300F-2?qs=NBx1VnXdadznR1WtAMXLew%3D%3D; ComponentLink3Description: Supplier 2 URL; ComponentLink3URL: https://www.digikey.com/en/products/detail/littelfuse-inc/MINISMDC300F-2/3885071?s=N4IgjCBcoGwBwCYqgMZQGYEMA2BnApgDQgD2UA2iAMwAEAgiALrEAOALlCAKoB2AlmwDy6ALL5MuAK4AnfCAC%2BxeFWQg0kLHiKkKIGPSasOkbvyGjxU2QqVwYq9ZoLEykSghgB2ACwBWJMwg7JwAymzSfDwA5jYgCAAMnkjQahg4zjpu4PHxBoHBJrwCwmISMnKKcYm%2BDmlaLrpU%2BgC2ggAWzbiGQcamxRZl1vKVyZTokgRM8kA; ComponentLink4Description: Supplier 3 URL; ComponentLink4URL: https://www.thegioiic.com/cau-chi-tu-phuc-hoi-1812-6v-3a; Supplier 1 Name: Mouser; Supplier 1 SN: 650-MINISMDC300F-2; Supplier 1 URL: https://www.mouser.vn/ProductDetail/Littelfuse/MINISMDC300F-2?qs=NBx1VnXdadznR1WtAMXLew%3D%3D; Supplier 2 Name: Digi-Key; Supplier 2 SN: MINISMDC300F-2TR-ND; Supplier 2 URL: https://www.mouser.vn/ProductDetail/Littelfuse/MINISMDC300F-2?qs=NBx1VnXdadznR1WtAMXLew%3D%3D; Supplier 3 Name: thegioiic; Supplier 3 SN: N/A; Supplier 3 URL: https://www.thegioiic.com/cau-chi-tu-phuc-hoi-1812-6v-3a; Value: 6V, 3A
P3-P6 P8 = HDR_Terminal: HDR_Terminal 2 pin; Supplier: ThegioiIC; ComponentLink1Description: URL; ComponentLink1URL: https://www.thegioiic.com/kf128-2-v-domino-2-chan-thang-3-5mm-300v-10a-han-pcb
P7 = 691312510002: as P1 on sheet MotherBoard_NucleoF401RE; ComponentLink1Description: Datasheet Link; ComponentLink1URL: https://www.we-online.com/redexpert/spec/691312510002?ad; ComponentLink2Description: Supplier 1 URL; ComponentLink2URL: N/A; Manufacturer Part Number: 691312510002; Category: Terminal Blocks; Match Code: WR-TBL; Mount: Through Hole; Operating Temperature Max: 105°C; Operating Temperature Min: -40°C; Packaging: Box; Application: Pluggable; Number of Pins: 2; Number of Rows: 1; Orientation: Horizontal; Pitch: 5.08mm; Rated Current: 20A; Working Voltage: 300V; ComponentLink3Description: Supplier 2 URL; ComponentLink3URL: N/A; ComponentLink4Description: Supplier 3 URL; ComponentLink4URL: https://www.thegioiic.com/kf-5-08-2-r-terminal-block-plug-in-han-pcb-2-chan-cong-5-08mm-300v-15a; Supplier 1 Name: Mouser; Supplier 1 SN: N/A; Supplier 1 URL: N/A; Supplier 2 Name: Digi-Key; Supplier 2 SN: N/A; Supplier 2 URL: N/A; Supplier 3 Name: thegioiic; Supplier 3 SN: N/A; Supplier 3 URL: https://www.thegioiic.com/kf-5-08-2-r-terminal-block-plug-in-han-pcb-2-chan-cong-5-08mm-300v-15a; Value: 20A, 300V
Q1-Q4 = MMBT2222A: TRANS NPN, 40V, 600MA, SOT23-3; DC Current Gain: 35-300; Gain Bandwidth Product fT: 250MHz; Power Dissipation: 250mW; Current - Collector: 600mA; Package: SOT-23; Supplier 1 Name: Mouser; Supplier 1 SN: 637-MMBT2222A; Supplier 1 URL: https://www.mouser.vn/ProductDetail/Diotec-Semiconductor/MMBT2222A?qs=OlC7AqGiEDl9N1c3%252BL%2F%252Brw%3D%3D; Supplier 2 Name: Digi-Key; Supplier 2 SN: 2796-MMBT2222ATR-ND; Supplier 2 URL: https://www.digikey.com/en/products/detail/diotec-semiconductor/MMBT2222A/13163394; Supplier 3 Name: thegioiic; Supplier 3 URL: https://www.thegioiic.com/mmbt2222a-transistor-npn-40v-0-6a-3-chan-sot-23; Transistor Type: NPN; Voltage - Collector Emitter Breakdown: 40V; Supplier 3 SN: N/A; Value: MMBT2222A; JLCPCB Part: C511875; ComponentLink1Description: JLCPCB Link; ComponentLink1URL: https://jlcpcb.com/partdetail/BORN-MMBT2222A/C511875
R3-R5 R9 = 0006031021: RES, size 0603, 1 KOhm, 1/4 W; Manufacture  Name: OEM; Resistance: 1 KOhm; Rated Power: 1/4 W; Resistance Tolerance: +/-1%; Size: 0603; Mounting Technology: SMT; Supplier 1 Name: Mouser; Supplier 1 SN: 71-RCS06031K00FKEA; Supplier 2 Name: Digi-Key; Supplier 2 SN: YAG5829TR-ND YAG5829CT-ND YAG5829DKR-ND; Supplier 1 URL: https://www.mouser.vn/ProductDetail/Vishay-Dale/RCS06031K00FKEA?qs=sGAEpiMZZMvdGkrng054t9clqp6gtJJdzI9PGMrTQi4RTIuHToNahw%3D%3D; Supplier 3 Name: thegioiic; Supplier 3 SN: N/A; Supplier 3 URL: N/A; Manufacture  SN: OEM; Value: 1 KOhm, 1/4 W; ComponentLink1Description: Datasheet link; ComponentLink1URL: https://www.yageo.com/upload/media/product/productsearch/datasheet/rchip/PYu-SR_20105_RoHS_L_10.pdf; ComponentLink2Description: Supplier 1 URL; ComponentLink2URL: N/A; ComponentLink3Description: Supplier 2 URL; ComponentLink3URL: https://www.digikey.com/en/products/detail/yageo/SR0603FR-7T1KL/9373103; ComponentLink4Description: Supplier 3 URL; ComponentLink4URL: N/A; Supplier 2 URL: https://www.digikey.com/en/products/detail/yageo/SR0603FR-7T1KL/9373103; JLCPCB Part: C375503; ComponentLink5Description: JLCPCB Link; ComponentLink5URL: https://jlcpcb.com/partdetail/Yageo-RT0603FRE071KL/C375503
R6-R8 = 0006035111: RES, size 0603, 510 Ohm, 1/4 W; Manufacture  Name: OEM; Resistance: 510 Ohm; Rated Power: 1/4 W; Resistance Tolerance: +/-1%; Size: 0603; Mounting Technology: SMT; Supplier 1 Name: Mouser; Supplier 1 SN: 667-ERJ-UP3F5100V; Supplier 2 Name: Digi-Key; Supplier 2 SN: P17401TR-ND P17401CT-ND P17401DKR-ND; Supplier 1 URL: https://www.mouser.vn/ProductDetail/Panasonic/ERJ-UP3F5100V?qs=sGAEpiMZZMvdGkrng054twq3eZrCFN89dfK8VohwH1n5T5ZGAc92MQ%3D%3D; Supplier 3 Name: thegioiic; Supplier 3 SN: N/A; Supplier 3 URL: N/A; Manufacture  SN: OEM; Value: 510 Ohm, 1/4 W; ComponentLink1Description: Datasheet link; ComponentLink1URL: https://industrial.panasonic.com/cdbs/www-data/pdf/RDN0000/AOA0000C313.pdf; ComponentLink2Description: Supplier 1 URL; ComponentLink2URL: N/A; ComponentLink3Description: Supplier 2 URL; ComponentLink3URL: https://www.digikey.com/en/products/detail/panasonic-electronic-components/ERJ-3BQFR51V/5647434; ComponentLink4Description: Supplier 3 URL; ComponentLink4URL: N/A; Supplier 2 URL: https://www.digikey.com/en/products/detail/panasonic-electronic-components/ERJ-3BQFR51V/5647434; JLCPCB Part: C140078; ComponentLink5Description: JLCPCB Link; ComponentLink5URL: https://jlcpcb.com/partdetail/151404-RS03K510JT/C140078
R10 = 0006031031: as R1 on sheet MotherBoard_NucleoF401RE; Size: 0603; Mounting Technology: SMT; Supplier 1 Name: Mouser; Supplier 1 SN: 755-ESR03EZPF1002; Supplier 2 Name: Digi-Key; Supplier 2 SN: RHM10KADTR-ND RHM10KADCT-ND RHM10KADDKR-ND; Supplier 1 URL: https://www.mouser.vn/ProductDetail/ROHM-Semiconductor/ESR03EZPF1002?qs=sGAEpiMZZMvdGkrng054t67Efho1F8r6CDeAsqwFse8%3D; Supplier 3 Name: thegioiic; Supplier 3 SN: N/A; Supplier 3 URL: N/A; Manufacture  SN: OEM; Value: 10 KOhm, 1/4 W; ComponentLink1Description: Datasheet link; ComponentLink1URL: https://fscdn.rohm.com/en/products/databook/datasheet/passive/resistor/chip_resistor/esr-e.pdf; ComponentLink2Description: Supplier 1 URL; ComponentLink2URL: https://www.thegioiic.com/dien-tro-10-kohm-0603-1-; ComponentLink3Description: Supplier 2 URL; ComponentLink3URL: https://www.digikey.com/en/products/detail/rohm-semiconductor/ESR03EZPF1002/1983429; ComponentLink4Description: Supplier 3 URL; ComponentLink4URL: N/A; Supplier 2 URL: https://www.digikey.com/en/products/detail/rohm-semiconductor/ESR03EZPF1002/1983429; JLCPCB Part: C2087321; Parameter 1: *; ComponentLink5Description: JLCPCB Link; ComponentLink5URL: https://jlcpcb.com/partdetail/Yageo-RT0603BRD1010KL/C2087321

## Sheet MotherBoard_Driver_Communication.SchDoc
size A; SheetNumber: 5; SheetTotal: 9
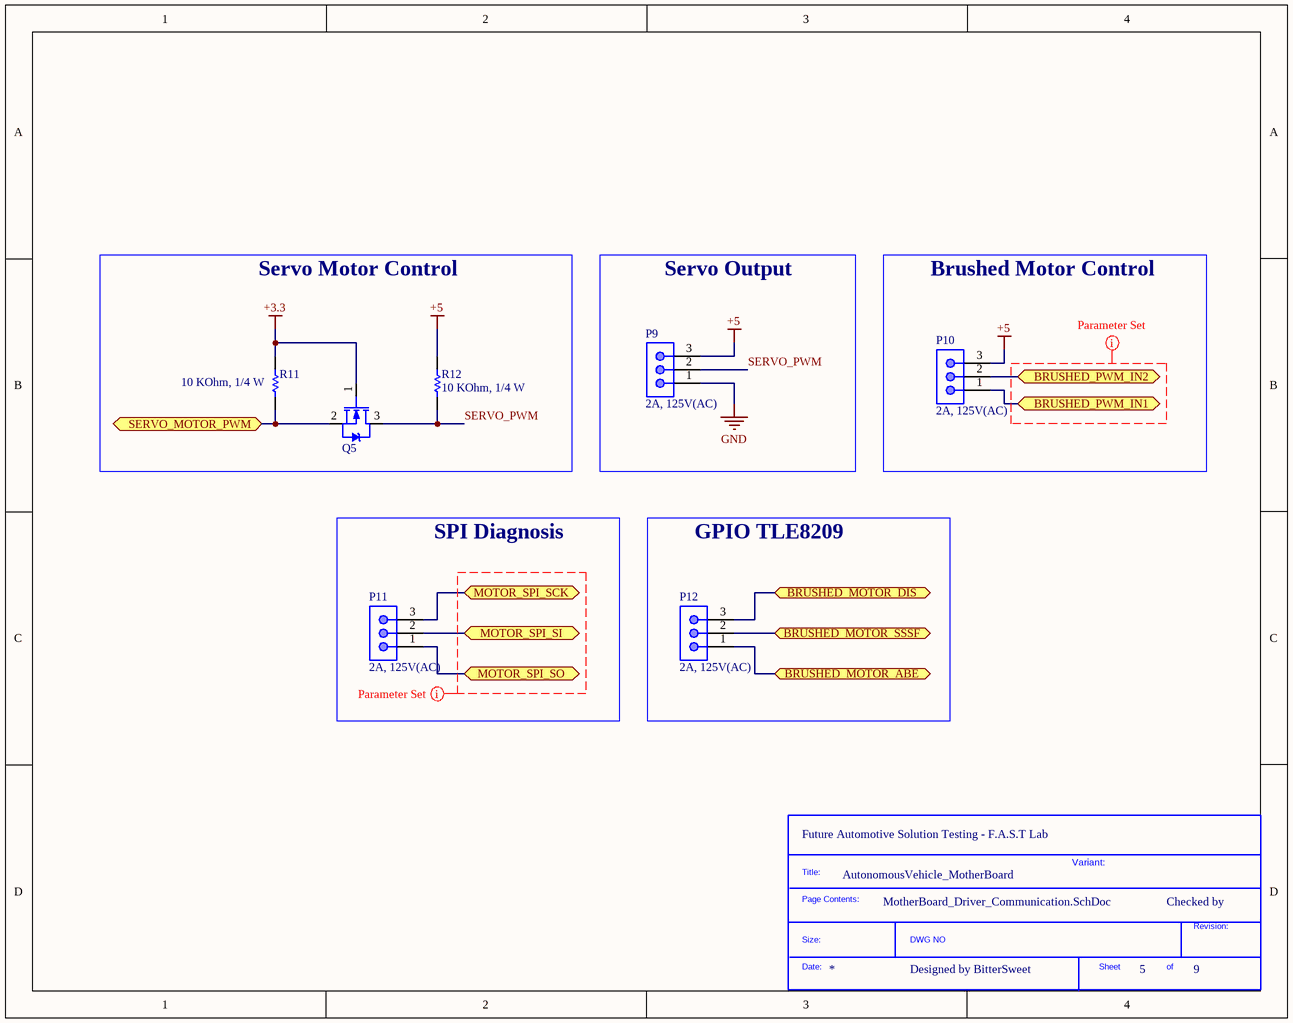
[diagram p4: MotherBoard_Driver_Communication.SchDoc]

### Parts
(Parts that share a designator on the sheet are numbered #1, #2 ... from top to bottom, then left to right.)
*?#5  SDTitleBlock  (value not drawn)  (graphical)
P9  2A, 125V(AC)  [620103131822]
P10  2A, 125V(AC)  [620103131822]
P11  2A, 125V(AC)  [620103131822]
P12  2A, 125V(AC)  [620103131822]
Q5  Mosfet_N_channel  [MOSFET_N_SOT23-3]  (value not drawn)
R11  10 KOhm, 1/4 W  [resistor_0603]
R12  10 KOhm, 1/4 W  [resistor_0603]

### Blocks framed on the sheet
Servo Motor Control: Q5 R11 R12
Servo Output: P9
Brushed Motor Control: P10
SPI Diagnosis: P11
GPIO TLE8209: P12

### Ports
BRUSHED_MOTOR_ABE (bidir), BRUSHED_MOTOR_DIS (bidir), BRUSHED_MOTOR_SSSF (bidir), BRUSHED_PWM_IN1 (bidir), BRUSHED_PWM_IN2 (bidir), MOTOR_SPI_SCK (bidir), MOTOR_SPI_SI (bidir), MOTOR_SPI_SO (bidir), SERVO_MOTOR_PWM (bidir)

### Nets
+3.3: Q5.1(G) R11.2
+5: P9.3 P10.3 R12.2
GND: P9.1
SERVO_PWM: P9.2 Q5.3(D) R12.1
NetP10_1: P10.1 ; port BRUSHED_PWM_IN1
NetP10_2: P10.2 ; port BRUSHED_PWM_IN2
NetP11_1: P11.1 ; port MOTOR_SPI_SO
NetP11_2: P11.2 ; port MOTOR_SPI_SI
NetP11_3: P11.3 ; port MOTOR_SPI_SCK
NetP12_1: P12.1 ; port BRUSHED_MOTOR_ABE
NetP12_2: P12.2 ; port BRUSHED_MOTOR_SSSF
NetP12_3: P12.3 ; port BRUSHED_MOTOR_DIS
NetQ5_2: Q5.2(S) R11.1 ; port SERVO_MOTOR_PWM

### Layout directives
net class SPI_DIAGNOSIS: (no net found under the mark)
net class BDC_PWM: (no net found under the mark)

### Notes on the sheet
- (near *?#5) Future Automotive Solution Testing - F.A.S.T Lab
- AutonomousVehicle_MotherBoard
- Variant:
- Checked by
- Designed by BitterSweet
- (in symbol SDTitleBlock) Title:; Page Contents:; Revision:; Size:; DWG NO; Date:; Sheet; of

### Library data of the parts
P9-P12 = 620103131822: WR-WTB SMT Male Horizontal Shrouded Header, pitch 2mm, 3p; Pin Number: 3; Contact Resistance: 20mOhm; Withstanding Voltage: 800VAC; Working Voltage: 100VAC; ComponentLink1Description: Manufacturer; ComponentLink1URL: http://www.we-online.de; ComponentLink2Description: Datasheet; ComponentLink2URL: https://www.we-online.com/catalog/datasheet/620103131822.pdf; Pitch: 2mm; Published Date: January 2020; Publisher: Wurth Elektronik; Mounting Technology: SMT; Packaging: Tape and Reel; Operating Temperature: -25 to +85degC; Part Number: 620103131822; Gender: Male; Type: Horizontal; Rated Current: 2A; ComponentLink3Description: Global Supply; ComponentLink3URL: https://www.we-online.com/en/components/products/WTB_2_00_SMT_MALE_HORIZONTAL_SHROUDED_HEADER_6201XX131822?sq=620103131822#620103131822; ComponentLink4Description: Global Supply; ComponentLink4URL: https://www.mouser.vn/ProductDetail/Wurth-Elektronik/620103131822?qs=ZtY9WdtwX54jBicvPVEzcw%3D%3D; Supplier 1 Name: Mouser; Supplier 1 SN: 710-620103131822; Supplier 1 URL: https://www.mouser.vn/ProductDetail/Wurth-Elektronik/620103131822?qs=ZtY9WdtwX54jBicvPVEzcw%3D%3D; Supplier 2 Name: Digi-Key; Supplier 2 SN: N/A; Supplier 2 URL: N/A; Supplier 3 Name: thegioiic; Supplier 3 SN: N/A; Supplier 3 URL: N/A; Value: 2A, 125V(AC)
R11 R12 = 0006031031: as R1 on sheet MotherBoard_NucleoF401RE; Size: 0603; Mounting Technology: SMT; Supplier 1 Name: Mouser; Supplier 1 SN: 755-ESR03EZPF1002; Supplier 2 Name: Digi-Key; Supplier 2 SN: RHM10KADTR-ND RHM10KADCT-ND RHM10KADDKR-ND; Supplier 1 URL: https://www.mouser.vn/ProductDetail/ROHM-Semiconductor/ESR03EZPF1002?qs=sGAEpiMZZMvdGkrng054t67Efho1F8r6CDeAsqwFse8%3D; Supplier 3 Name: thegioiic; Supplier 3 SN: N/A; Supplier 3 URL: N/A; Manufacture  SN: OEM; Value: 10 KOhm, 1/4 W; ComponentLink1Description: Datasheet link; ComponentLink1URL: https://fscdn.rohm.com/en/products/databook/datasheet/passive/resistor/chip_resistor/esr-e.pdf; ComponentLink2Description: Supplier 1 URL; ComponentLink2URL: https://www.thegioiic.com/dien-tro-10-kohm-0603-1-; ComponentLink3Description: Supplier 2 URL; ComponentLink3URL: https://www.digikey.com/en/products/detail/rohm-semiconductor/ESR03EZPF1002/1983429; ComponentLink4Description: Supplier 3 URL; ComponentLink4URL: N/A; Supplier 2 URL: https://www.digikey.com/en/products/detail/rohm-semiconductor/ESR03EZPF1002/1983429; JLCPCB Part: C2087321; Parameter 1: *; ComponentLink5Description: JLCPCB Link; ComponentLink5URL: https://jlcpcb.com/partdetail/Yageo-RT0603BRD1010KL/C2087321
Q5 = Mosfet_N_channel: ComponentLink1Description: JLCPCB Link; ComponentLink1URL: https://jlcpcb.com/partdetail/HXYMOSFET-Si2300DS_T1_GE3HXY/C22367238; JLCPCB Part: C22367238

## Sheet MotherBoard_Measure_Communication.SchDoc
size A; SheetNumber: 6; SheetTotal: 9
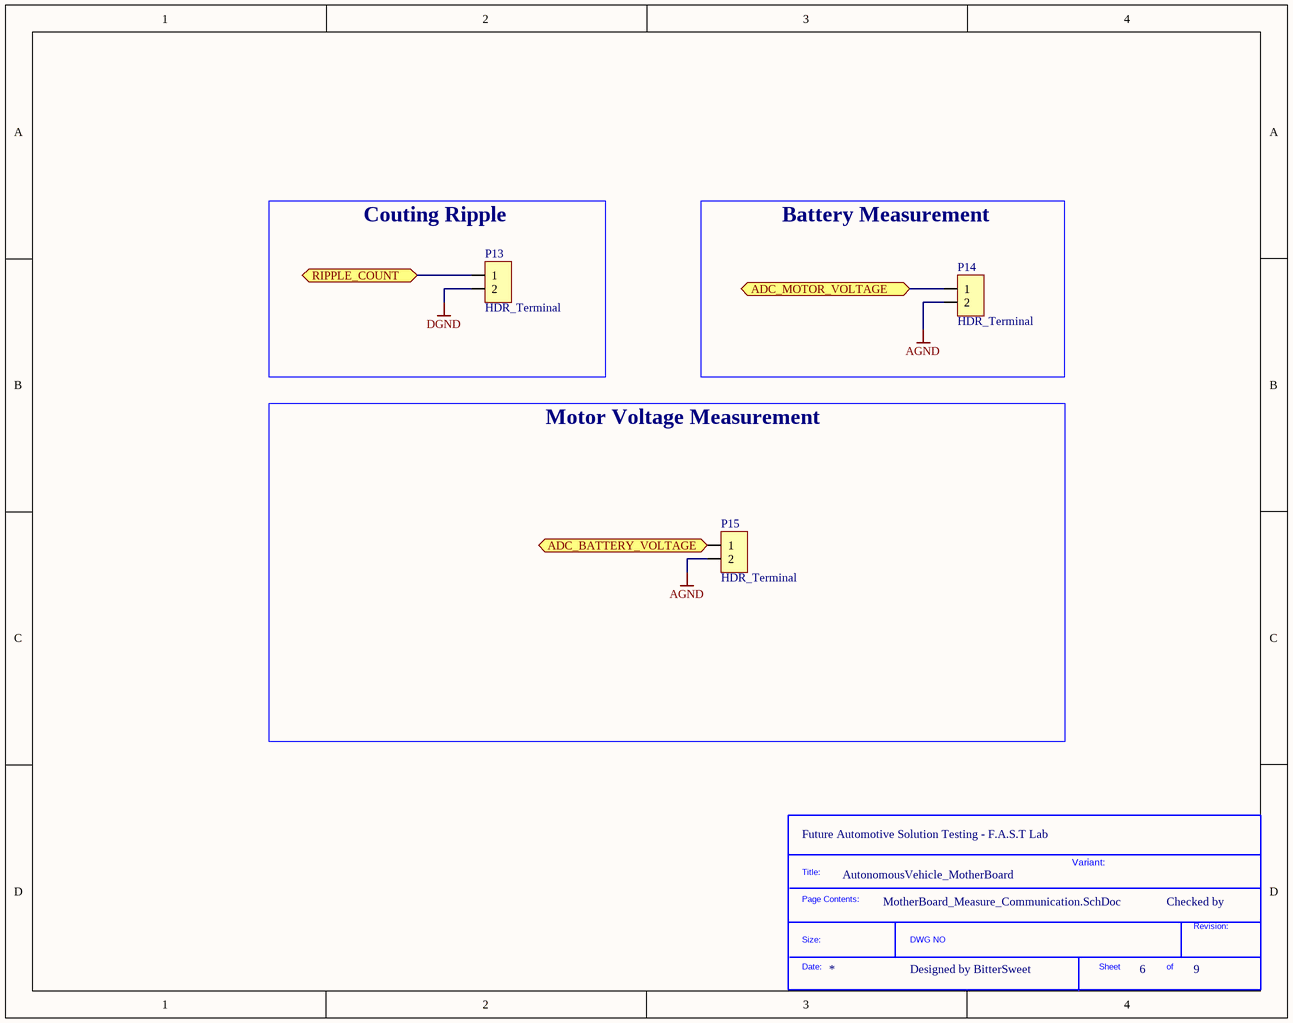
[diagram p5: MotherBoard_Measure_Communication.SchDoc]

### Parts
(Parts that share a designator on the sheet are numbered #1, #2 ... from top to bottom, then left to right.)
*?#6  SDTitleBlock  (value not drawn)  (graphical)
P13  HDR_Terminal  [HDR_HEADER_2.0_HORIZONTAL]
P14  HDR_Terminal  [HDR_HEADER_2.0_HORIZONTAL]
P15  HDR_Terminal  [HDR_HEADER_2.0_HORIZONTAL]

### Blocks framed on the sheet
Couting Ripple: P13
Battery Measurement: P14
Motor Voltage Measurement: P15

### Ports
ADC_BATTERY_VOLTAGE (bidir), ADC_MOTOR_VOLTAGE (bidir), RIPPLE_COUNT (bidir)

### Nets
AGND: P14.2 P15.2
DGND: P13.2
NetP13_1: P13.1 ; port RIPPLE_COUNT
NetP14_1: P14.1 ; port ADC_MOTOR_VOLTAGE
NetP15_1: P15.1 ; port ADC_BATTERY_VOLTAGE

### Notes on the sheet
- (near *?#6) Future Automotive Solution Testing - F.A.S.T Lab
- AutonomousVehicle_MotherBoard
- Variant:
- Checked by
- Designed by BitterSweet
- (in symbol SDTitleBlock) Title:; Page Contents:; Revision:; Size:; DWG NO; Date:; Sheet; of

### Library data of the parts
P13-P15 = HDR_Terminal: HDR_Terminal 2 pin; Supplier: ThegioiIC; ComponentLink1Description: URL; ComponentLink1URL: https://www.thegioiic.com/kf128-2-v-domino-2-chan-thang-3-5mm-300v-10a-han-pcb